# EAGLE design control pipe v2 (EAGLE 8.3.2)
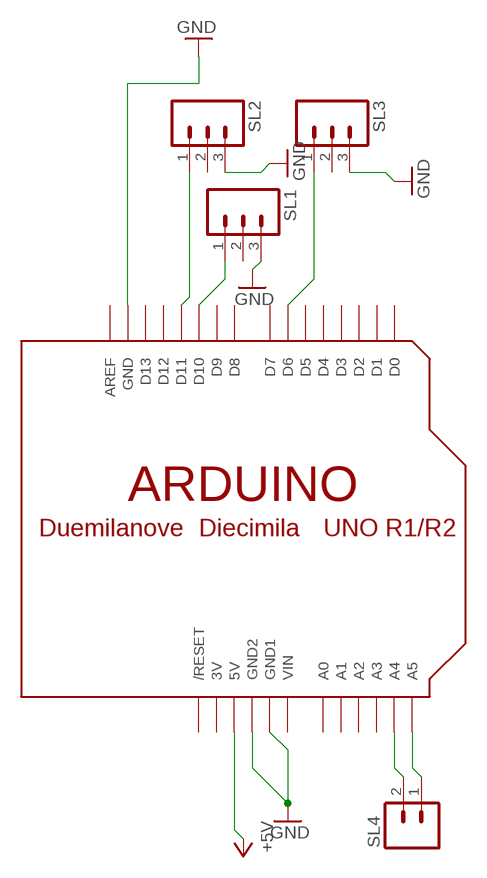
[diagram p0: schematic, sheet 1]

## Parts
SL1  M03  [03P]
SL2  M03  [03P]
SL3  M03  [03P]
SL4  M02  [02P]
U$1  ARDUINO-NODIM  [ARDUINO-NODIM]

## Nets
+5V: U$1.5V
GND: SL1.3 SL2.3 SL3.3 U$1.GND U$1.GND1 U$1.GND2
N$1: SL4.2 U$1.A4
N$2: SL2.1 U$1.D11
N$3: SL1.1 U$1.D10
N$4: SL3.1 U$1.D6
N$5: SL4.1 U$1.A5
Unconnected: SL1.2 SL2.2 SL3.2 U$1.A0 U$1.A1 U$1.A2 U$1.A3 U$1.AREF U$1.D0 U$1.D1 U$1.D2 U$1.D3 U$1.D4 U$1.D5 U$1.D7 U$1.D8 U$1.D9 U$1.D12 U$1.D13 U$1.RESET(/RESET)

## Power pins joined to a net without a drawn wire
3V: U$1.3V
VIN: U$1.VIN

## Library data of the parts
SL1-SL3 = con-amp-quick:M03: AMP QUICK CONNECTOR; OC_FARNELL: unknown; OC_NEWARK: unknown
SL4 = con-amp-quick:M02: AMP QUICK CONNECTOR; OC_FARNELL: unknown; OC_NEWARK: unknown
U$1 = adafruit:ARDUINO: Arduino Diecimila/Duemilanove Make a shield with ease, this package has all the named pins as well as the two mounting drill holes and an outline of the USB and DC power connector. The outline is on the DIMENSION layer, so if your board house uses it they will cut the outline to match. http://www.ladyada.net/library/pcb/eaglelibrary.html

## Board
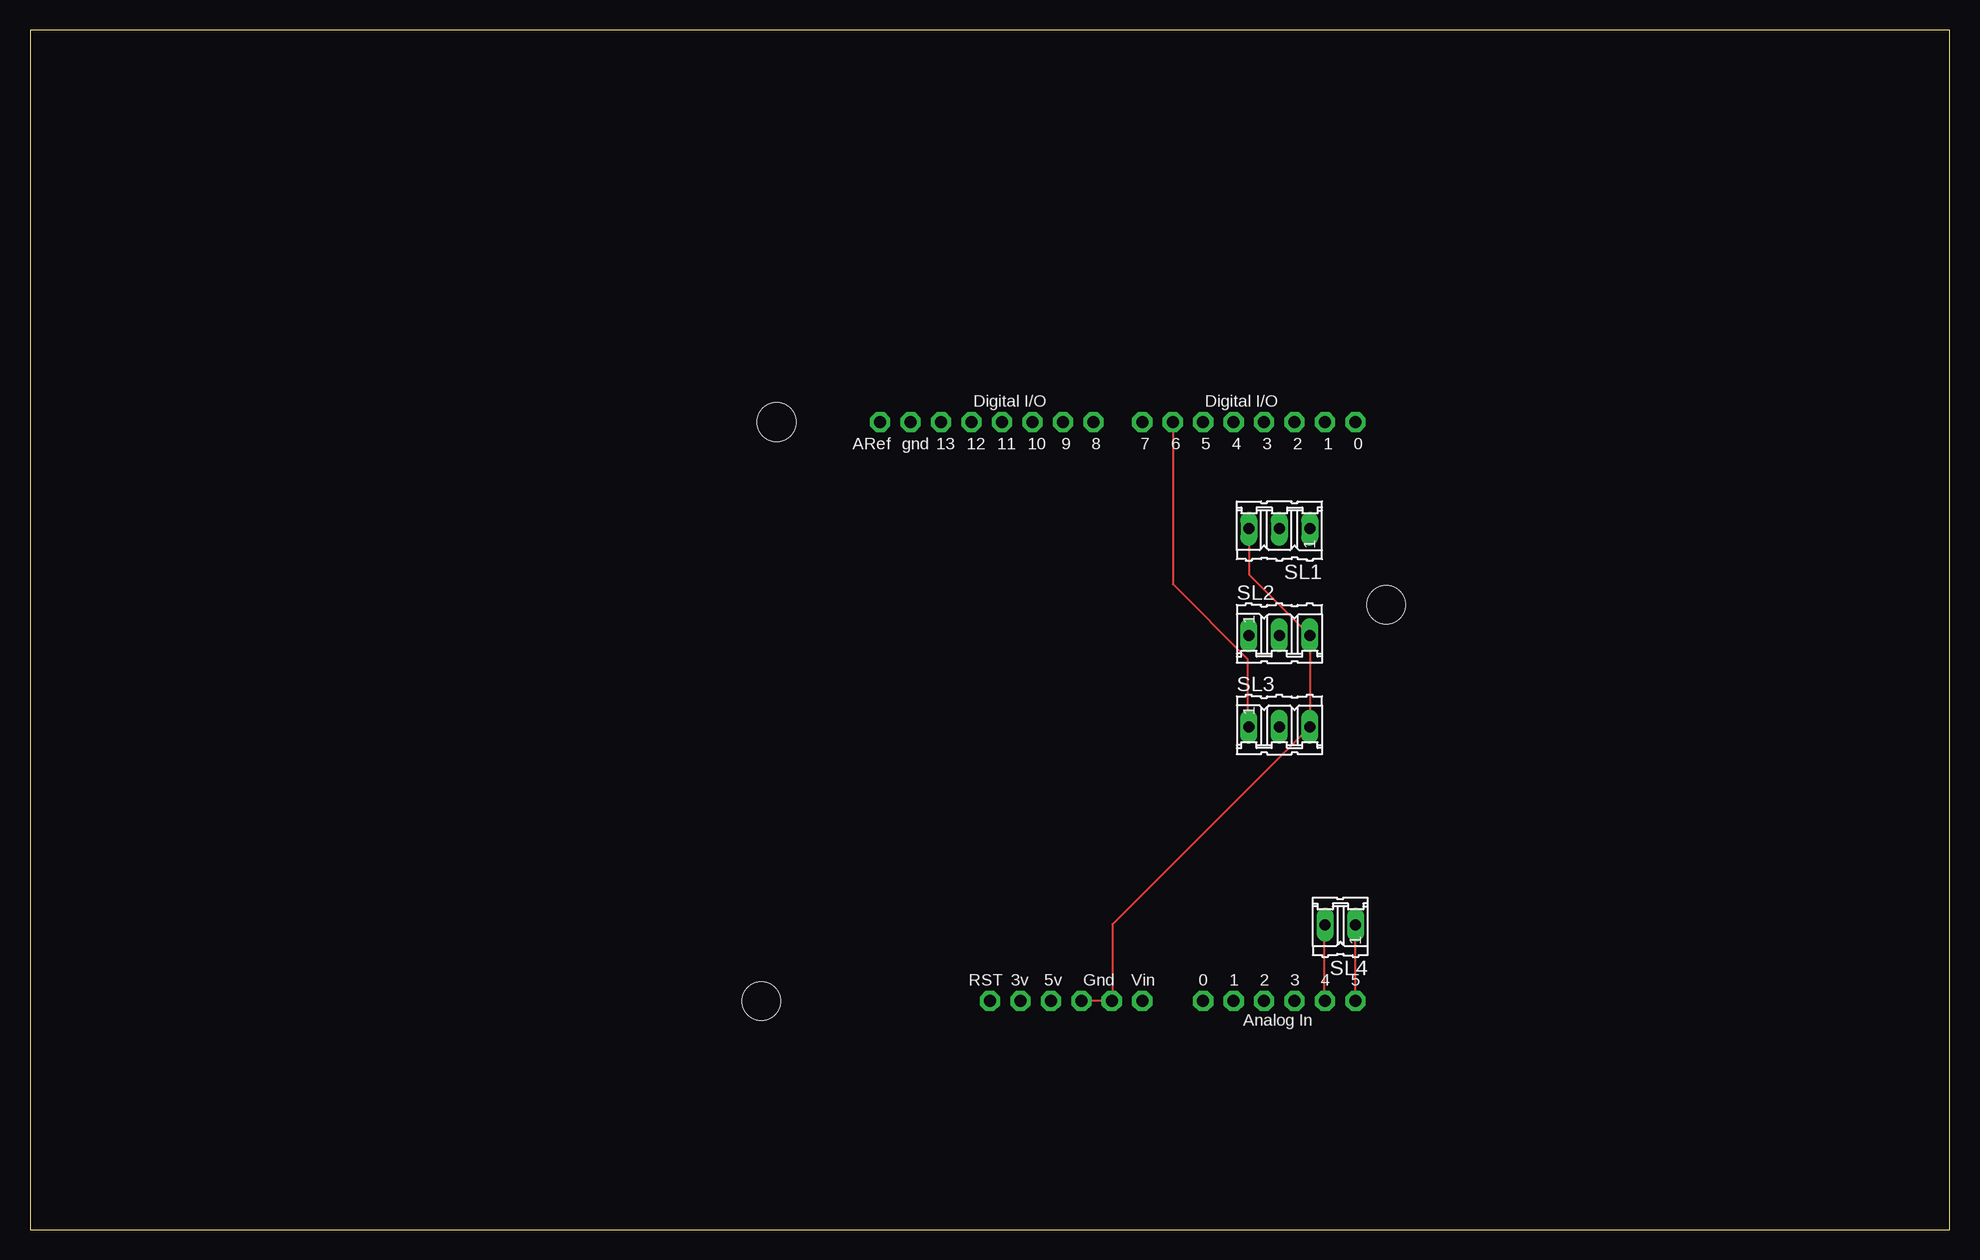
[diagram p1: board, top side]
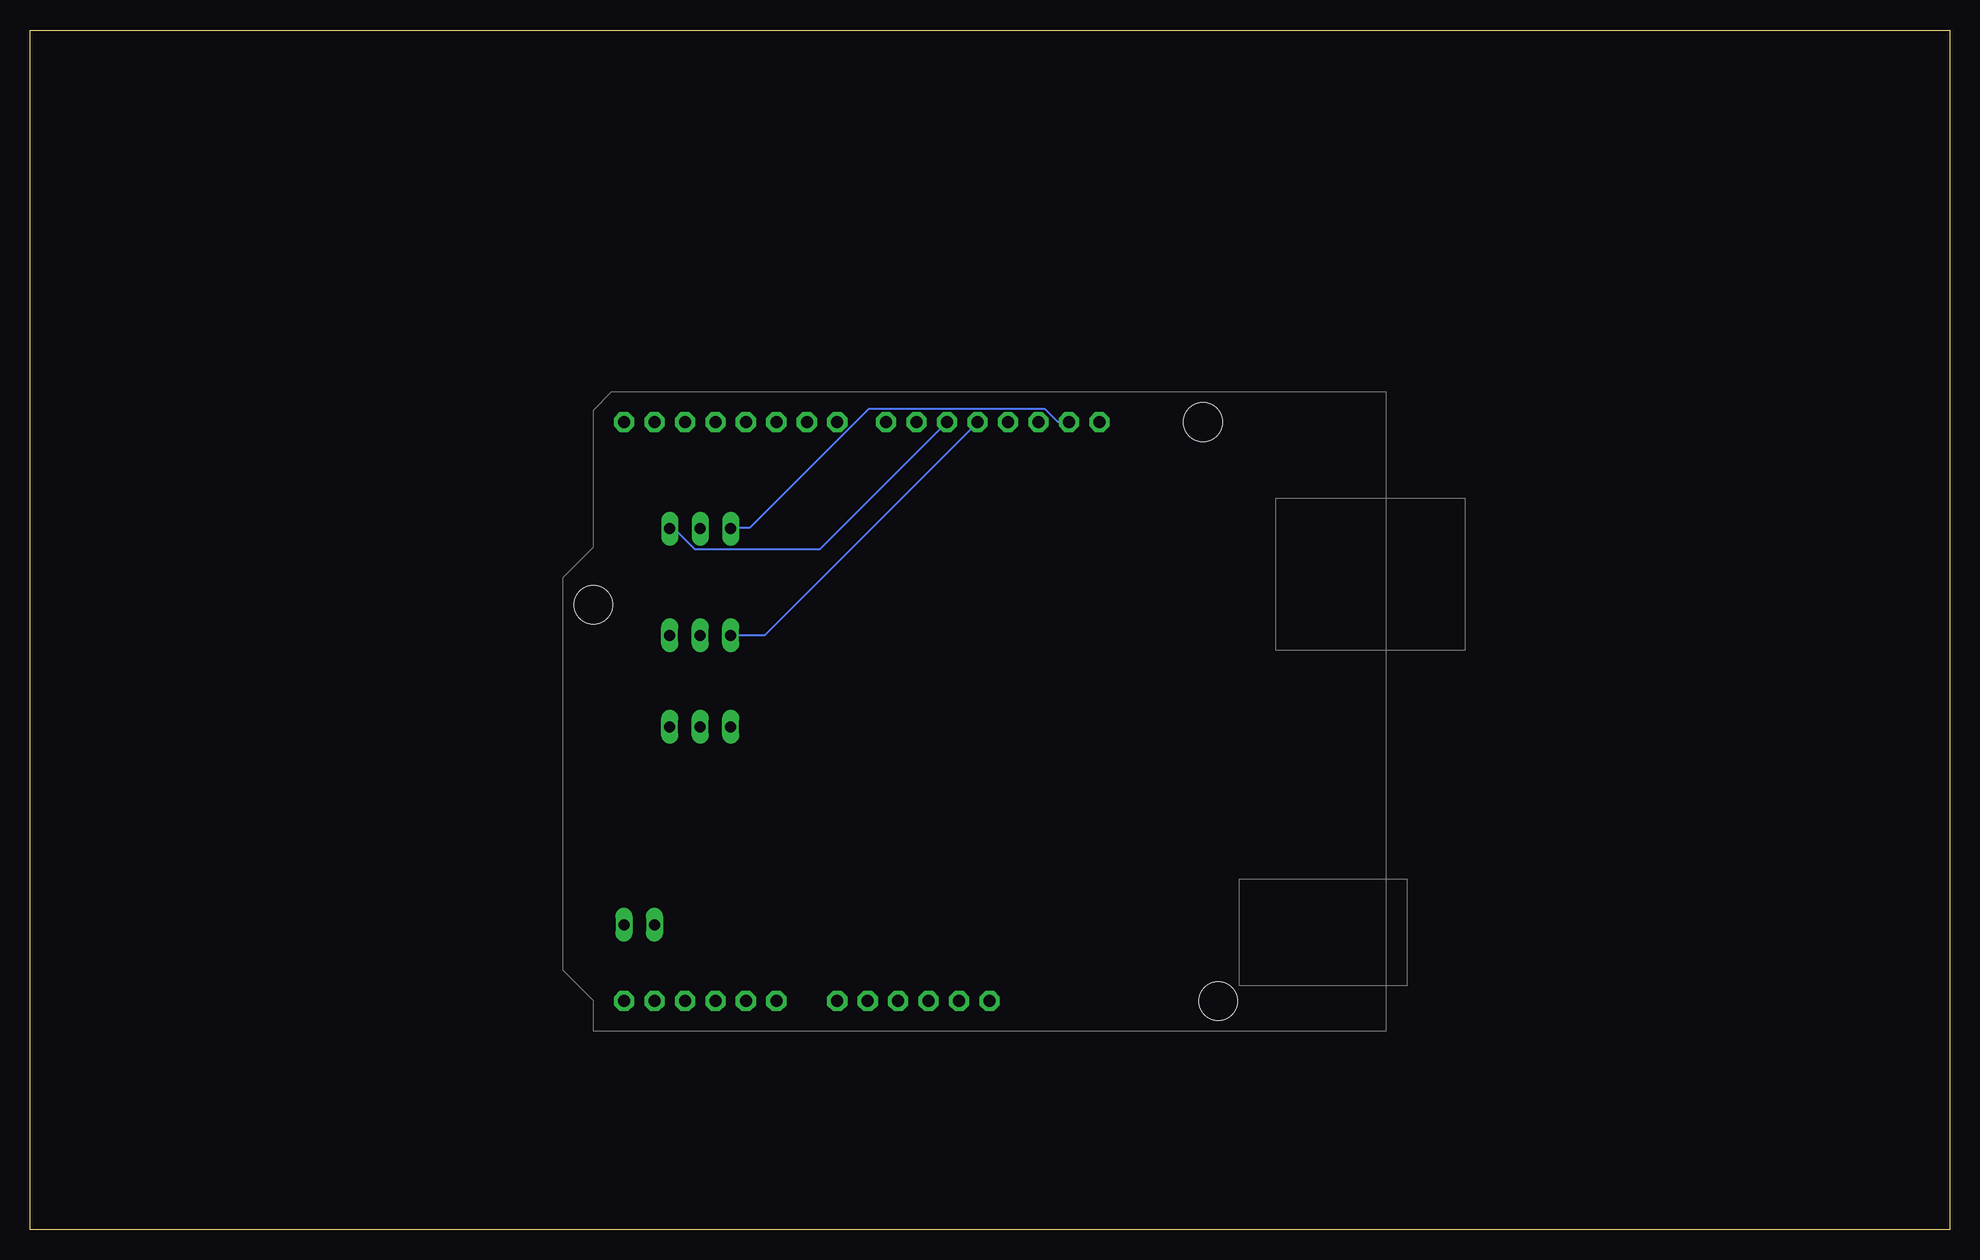
[diagram p2: board, bottom side, seen from below]

Size 160 x 100 mm. Coordinates in mm from the lower left corner, seen from the top.
Outline: 0,0 160,0 160,100 0,100 0,0
Copper layers (1*16): Top 0.035mm / dielectric 1.5mm / Bottom 0.035mm
Design rules "default": minimum track width 6mil, minimum drill 0.35mm, track to track 6mil, track to pad 6mil, pad to pad 6mil, via to via 6mil, smd to smd 6mil, copper to edge 40mil, drill to drill 6mil, minimum pad ring 10mil, minimum via ring 8mil, stop-mask expansion 4mil, vias tented up to drill 0mil, thermal gap 10mil

### Footprints (pad centres in the part's own frame; a part is rotated, then mirrored left to right if it is on the bottom)
03P = drill 0.914 long: 1 -2.54,0; 2 0,0; 3 2.54,0
02P = drill 0.914 long: 1 -1.27,0; 2 1.27,0
ARDUINO-NODIM = drill 1 pad 1.676 octagon: 3V 35.56,2.54; 5V 38.1,2.54; A0 50.8,2.54; A1 53.34,2.54; A2 55.88,2.54; A3 58.42,2.54; A4 60.96,2.54; A5 63.5,2.54; AREF 23.876,50.8; D0 63.5,50.8; D1 60.96,50.8; D2 58.42,50.8; D3 55.88,50.8; D4 53.34,50.8; D5 50.8,50.8; D6 48.26,50.8; D7 45.72,50.8; D8 41.656,50.8; D9 39.116,50.8; D10 36.576,50.8; D11 34.036,50.8; D12 31.496,50.8; D13 28.956,50.8; GND 26.416,50.8; GND1 43.18,2.54; GND2 40.64,2.54; RESET 33.02,2.54; VIN 45.72,2.54 | hole 3.2: 15.24,50.8; 66.04,35.56; 13.97,2.54

### Placement (x,y rotation side)
SL1  104.14,58.42 180 top
SL2  104.14,49.53 0 top
SL3  104.14,41.91 0 top
SL4  109.22,25.4 180 top
U$1  46.99,16.51 0 top

### Tracks (layer width: path | path; a pad name or v marks a point on that pad's centre or on a via)
GND
  Top 0.152: U$1.GND2 U$1.GND1 90.22,19.05 90.22,25.45 SL3.3 SL2.3 101.65,54.56 101.65,58.37 SL1.3
  Bottom 0.152: U$1.GND 73.46,67.36 74.37,67.36 75.44,68.43 90.07,68.43 99.97,58.52 101.5,58.52 SL1.3
N$1
  Top 0.152: SL4.2 107.9,25.3 107.9,19.05 U$1.A4
N$2
  Bottom 0.152: SL2.1 98.75,49.53 81.08,67.21 U$1.D11
N$3
  Bottom 0.152: U$1.D10 94.18,56.69 104.55,56.69 106.22,58.37 106.68,58.37 SL1.1
N$4
  Top 0.152: U$1.D6 95.25,53.8 101.5,47.55 101.5,41.91 SL3.1
N$5
  Top 0.152: U$1.A5 SL4.1